# Altium schematic sheet main.SchDoc
size A4; SheetNumber: 1; SheetTotal: 4
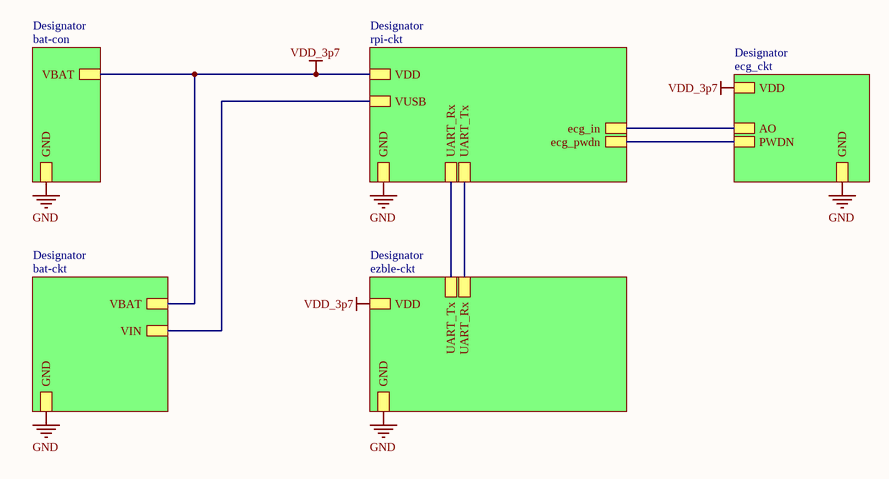
[diagram p0: main.SchDoc]

## Sub-sheets
Designator = bat-ckt: VBAT, GND, VIN
Designator = bat-con: VBAT, GND
Designator = rpi-ckt: VUSB, VDD, GND, UART_Tx, UART_Rx, ecg_in, ecg_pwdn
Designator = ezble-ckt: UART_Tx, UART_Rx, VDD, GND
Designator = ecg_ckt: VDD, AO, PWDN, GND

## Nets
GND: sheet Designator/GND, sheet Designator/GND, sheet Designator/GND, sheet Designator/GND, sheet Designator/GND
VDD_3p7: sheet Designator/VBAT, sheet Designator/VBAT, sheet Designator/VDD, sheet Designator/VDD, sheet Designator/VDD
(unnamed): sheet Designator/VIN, sheet Designator/VUSB
(unnamed): sheet Designator/UART_Tx, sheet Designator/UART_Rx
(unnamed): sheet Designator/UART_Rx, sheet Designator/UART_Tx
(unnamed): sheet Designator/ecg_in, sheet Designator/AO
(unnamed): sheet Designator/ecg_pwdn, sheet Designator/PWDN